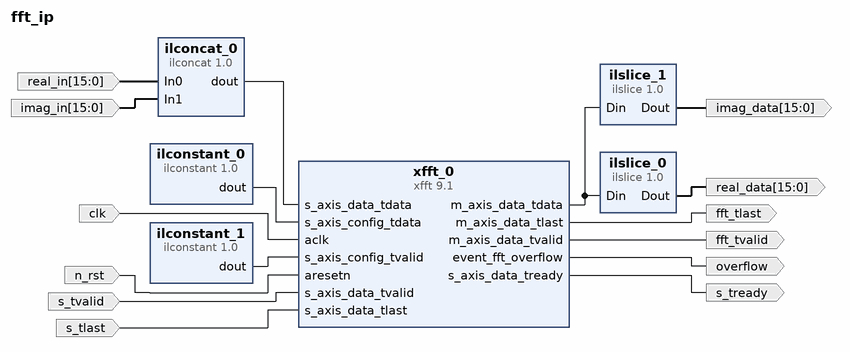
[diagram p0: block diagram of the top level]
# Vivado block design fft_ip, xc7a100tcsg324-1, Vivado 2025.1
create_bd_design fft_ip

create_bd_port -dir O -from 15 -to 0 real_data
create_bd_port -dir O -from 15 -to 0 imag_data
create_bd_port -dir O fft_tlast
create_bd_port -dir O fft_tvalid
create_bd_port -dir I -from 15 -to 0 real_in
create_bd_port -dir I -from 15 -to 0 imag_in
create_bd_port -dir O s_tready
create_bd_port -dir I s_tlast
create_bd_port -dir I s_tvalid
create_bd_port -dir I -type clk clk
set_property -dict {CONFIG.ASSOCIATED_RESET n_rst CONFIG.FREQ_HZ 200000000} [get_bd_ports clk]
create_bd_port -dir I -type rst n_rst
create_bd_port -dir O overflow

create_bd_cell -type ip -vlnv xilinx.com:ip:xfft:9.1 xfft_0
set_property -dict [list \
  CONFIG.aresetn true \
  CONFIG.cyclic_prefix_insertion false \
  CONFIG.data_format fixed_point \
  CONFIG.implementation_options pipelined_streaming_io \
  CONFIG.input_width 16 \
  CONFIG.number_of_stages_using_block_ram_for_data_and_phase_factors 1 \
  CONFIG.output_ordering natural_order \
  CONFIG.ovflo true \
  CONFIG.phase_factor_width 34 \
  CONFIG.run_time_configurable_transform_length false \
  CONFIG.scaling_options scaled \
  CONFIG.super_sample_rates 1 \
  CONFIG.target_clock_frequency 100 \
  CONFIG.throttle_scheme nonrealtime \
  CONFIG.transform_length 256 \
] [get_bd_cells xfft_0]
create_bd_cell -type inline_hdl -vlnv xilinx.com:inline_hdl:ilslice:1.0 ilslice_0
set_property -dict {CONFIG.DIN_FROM 15 CONFIG.DOUT_WIDTH 16} [get_bd_cells ilslice_0]
create_bd_cell -type inline_hdl -vlnv xilinx.com:inline_hdl:ilslice:1.0 ilslice_1
set_property -dict {CONFIG.DIN_FROM 31 CONFIG.DIN_TO 16} [get_bd_cells ilslice_1]
create_bd_cell -type inline_hdl -vlnv xilinx.com:inline_hdl:ilconcat:1.0 ilconcat_0
set_property -dict {CONFIG.IN0_WIDTH 16 CONFIG.IN1_WIDTH 16} [get_bd_cells ilconcat_0]
create_bd_cell -type inline_hdl -vlnv xilinx.com:inline_hdl:ilconstant:1.0 ilconstant_0
set_property -dict {CONFIG.CONST_VAL 0 CONFIG.CONST_WIDTH 16} [get_bd_cells ilconstant_0]
create_bd_cell -type inline_hdl -vlnv xilinx.com:inline_hdl:ilconstant:1.0 ilconstant_1

# ---- connections ----

connect_bd_net -net In0_0_1 [get_bd_ports real_in] [get_bd_pins ilconcat_0/In0]
connect_bd_net -net In1_0_1 [get_bd_ports imag_in] [get_bd_pins ilconcat_0/In1]
connect_bd_net -net aclk_0_1 [get_bd_ports clk] [get_bd_pins xfft_0/aclk]
connect_bd_net -net aresetn_0_1 [get_bd_ports n_rst] [get_bd_pins xfft_0/aresetn]
connect_bd_net [get_bd_pins ilconcat_0/dout] [get_bd_pins xfft_0/s_axis_data_tdata]
connect_bd_net [get_bd_pins ilconstant_0/dout] [get_bd_pins xfft_0/s_axis_config_tdata]
connect_bd_net [get_bd_pins ilconstant_1/dout] [get_bd_pins xfft_0/s_axis_config_tvalid]
connect_bd_net [get_bd_pins ilslice_0/Dout] [get_bd_ports real_data]
connect_bd_net [get_bd_pins ilslice_1/Dout] [get_bd_ports imag_data]
connect_bd_net -net s_axis_data_tvalid_0_1 [get_bd_ports s_tvalid] [get_bd_pins xfft_0/s_axis_data_tvalid]
connect_bd_net [get_bd_ports s_tlast] [get_bd_pins xfft_0/s_axis_data_tlast]
connect_bd_net [get_bd_pins xfft_0/event_fft_overflow] [get_bd_ports overflow]
connect_bd_net [get_bd_pins xfft_0/m_axis_data_tdata] [get_bd_pins ilslice_0/Din] [get_bd_pins ilslice_1/Din]
connect_bd_net [get_bd_pins xfft_0/m_axis_data_tlast] [get_bd_ports fft_tlast]
connect_bd_net [get_bd_pins xfft_0/m_axis_data_tvalid] [get_bd_ports fft_tvalid]
connect_bd_net [get_bd_pins xfft_0/s_axis_data_tready] [get_bd_ports s_tready]

validate_bd_design
save_bd_design
